# Altium schematic sheet Brduino-PwrLin.SchDoc: BRDUINO
size A3; Organization: TDK Micronas; DocumentNumber: tbd; Revision: 0.00.001; SheetNumber: 4; SheetTotal: 4; Date: 8/14/2020; DrawnBy: Moerz; Engineer: Moerz
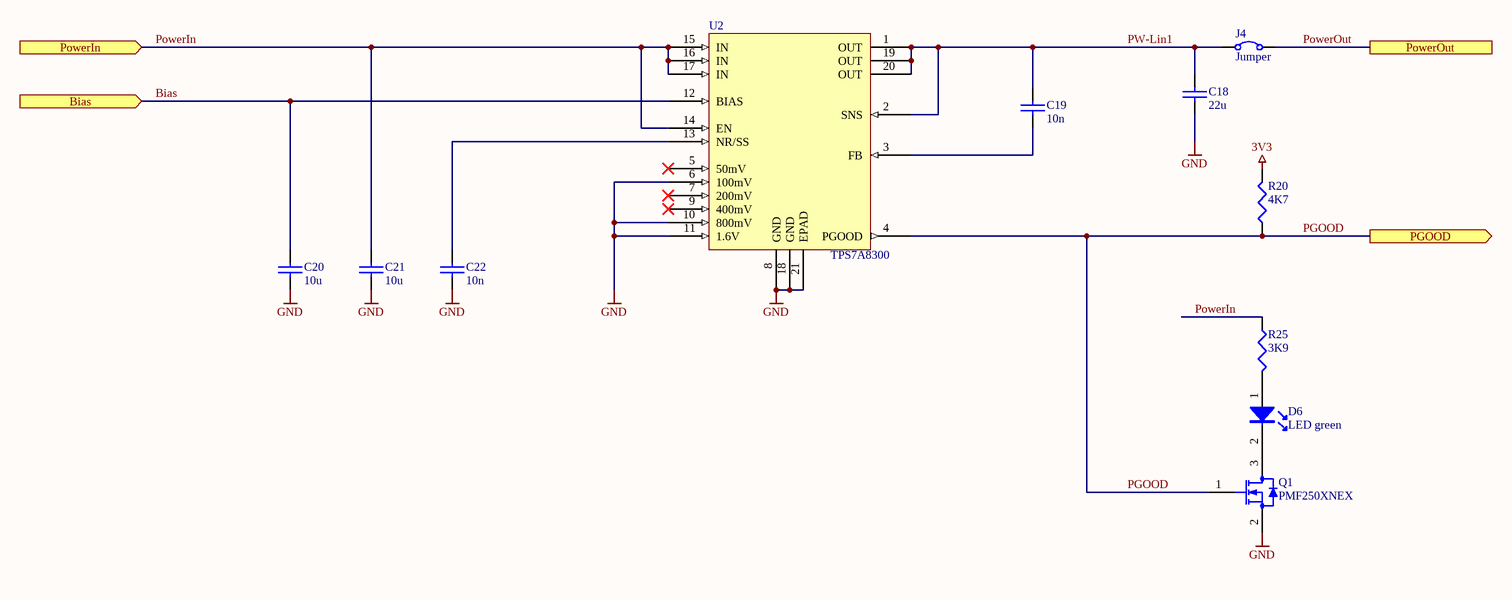
[diagram p0: Brduino-PwrLin.SchDoc]

## Parts
C18  22u  [C0805]
C19  10n  [C0402]
C20  10u  [C0805]
C21  10u  [C0805]
C22  10n  [C0402]
D6  LED green  [LED0603]
J4  Jumper  [JumperSMD]  (no BOM)
Q1  PMF250XNEX  [SOT323]
R20  4K7  [R0402]
R25  3K9  [R0402]
U2  TPS7A8300  [S-PVQFN-N20]

## Ports
Bias (in), PGOOD (out), PowerIn (in), PowerOut

## Nets
3V3: R20.2
GND: C18.1 C20.1 C21.1 C22.2 Q1.2(S) U2.6(100mV) U2.8(GND) U2.10(800mV) U2.11(1.6V) U2.18(GND) U2.21(EPAD)
Bias: C20.2 U2.12(BIAS) ; port Bias
PGOOD: Q1.1(G) R20.1 U2.4(PGOOD) ; port PGOOD
PowerIn: C21.2 R25.1 U2.14(EN) U2.15(IN) U2.16(IN) U2.17(IN) ; port PowerIn
PowerOut: J4.2 ; port PowerOut
PW-Lin1: C18.2 C19.1 J4.1 U2.1(OUT) U2.2(SNS) U2.19(OUT) U2.20(OUT)
NetC19_2: C19.2 U2.3(FB)
NetC22_1: C22.1 U2.13(NR/SS)
NetD6_1: D6.1(A) R25.2
NetD6_2: D6.2(K) Q1.3(D)

Not connected (* = marked no-connect by the designer): U2 5(50mV)* 7(200mV)* 9(400mV)*

## Notes on the sheet
- Title
- Size:
- Date:
- A3
- Number:
- Time:
- Revision:
- Sheet
- of
- R
- Schlossstrasse 50
- D-66352 Karlsbrunn
- Germany
- Engineering GmbH
- ev
- ision
- O
- ne
- File:

## Library data of the parts
C18 = CAP: MFR-PN: GRM21BR61A226ME44#; MFR: MURATA; Parameters: X5R, 10V, 10%; POPULATED: yes
C19 C22 = CAP: MFR-PN: GRM155R71H103KA88#; MFR: MURATA; POPULATED: yes; Parameters: X7R, 50V, 10%
C20 C21 = CAP: MFR-PN: GRM21BR61E106KA73#; MFR: MURATA; Parameters: X5R, 25V, 10%; POPULATED: yes
D6 = LED: MFR-PN: APHD1608LCGCK; MFR: KINGBRIGHT; POPULATED: yes; Parameters: If >= 2mA
J4 = Jumper: POPULATED: yes
Q1 = MOSFET-N-D: N-Channel MOSFET; MFR: NEXPERIA; POPULATED: yes; MFR-PN: PMF250XNEX
R20 R25 = RES1A: POPULATED: yes; Parameters: 1/16W, 50V, 1%
U2 = TPS7A8300: MFR-PN: TPS7A8300RGWT; MFR: TI; POPULATED: yes